# EAGLE schematic LTC6240CS8PBF_breakout (EAGLE 8.5.1)
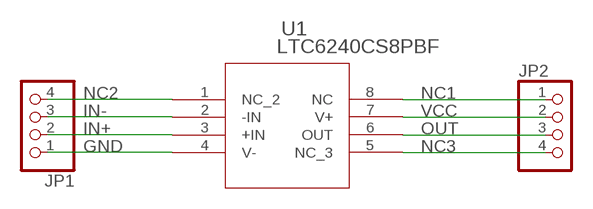
[diagram p0: schematic, sheet 1]

## Parts
JP1  PINHD-1X4  [1X04]
JP2  PINHD-1X4  [1X04]
U1  LTC6240CS8PBF  [SO-8_S]

## Nets
GND: JP1.1 U1.4(V-)
IN+: JP1.2 U1.3(+IN)
IN-: JP1.3 U1.2(-IN)
NC1: JP2.1 U1.8(NC)
NC2: JP1.4 U1.1(NC_2)
NC3: JP2.4 U1.5(NC_3)
OUT: JP2.3 U1.6(OUT)
VCC: JP2.2 U1.7(V+)

## Library data of the parts
JP1 JP2 = pinhead:PINHD-1X4: PIN HEADER
U1 = LTC6240CS8PBF:LTC6240CS8PBF; AVAILABILITY: Good; DESCRIPTION: LTC6240 Op Amp CMOS R-R SOICN-8; MF: Linear Technology; MP: LTC6240CS8#PBF; PACKAGE: SOIC-8 Linear Technology; PRICE: 1.20 USD